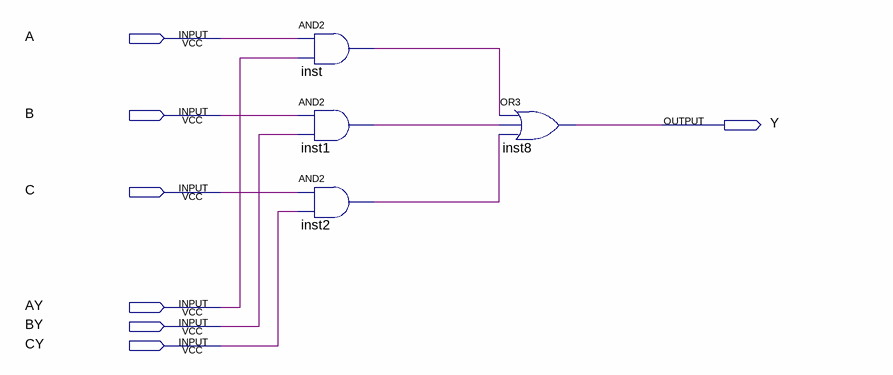
[diagram p0: schematic sheet]
// Quartus schematic MY_DATASELECTOR3.bdf as structural Verilog: 4 symbols, 7 pins
module MY_DATASELECTOR3 (
  input  A,
  input  B,
  input  C,
  input  AY,
  input  BY,
  input  CY,
  output Y
);

  wire inst1_out, inst2_out, inst_out;

  and inst (inst_out, A, AY);
  and inst1 (inst1_out, B, BY);
  and inst2 (inst2_out, C, CY);
  or inst8 (Y, inst_out, inst1_out, inst2_out);
endmodule
